# EAGLE design D32 Pro Breakout - TFT Touch (EAGLE 9.5.2)
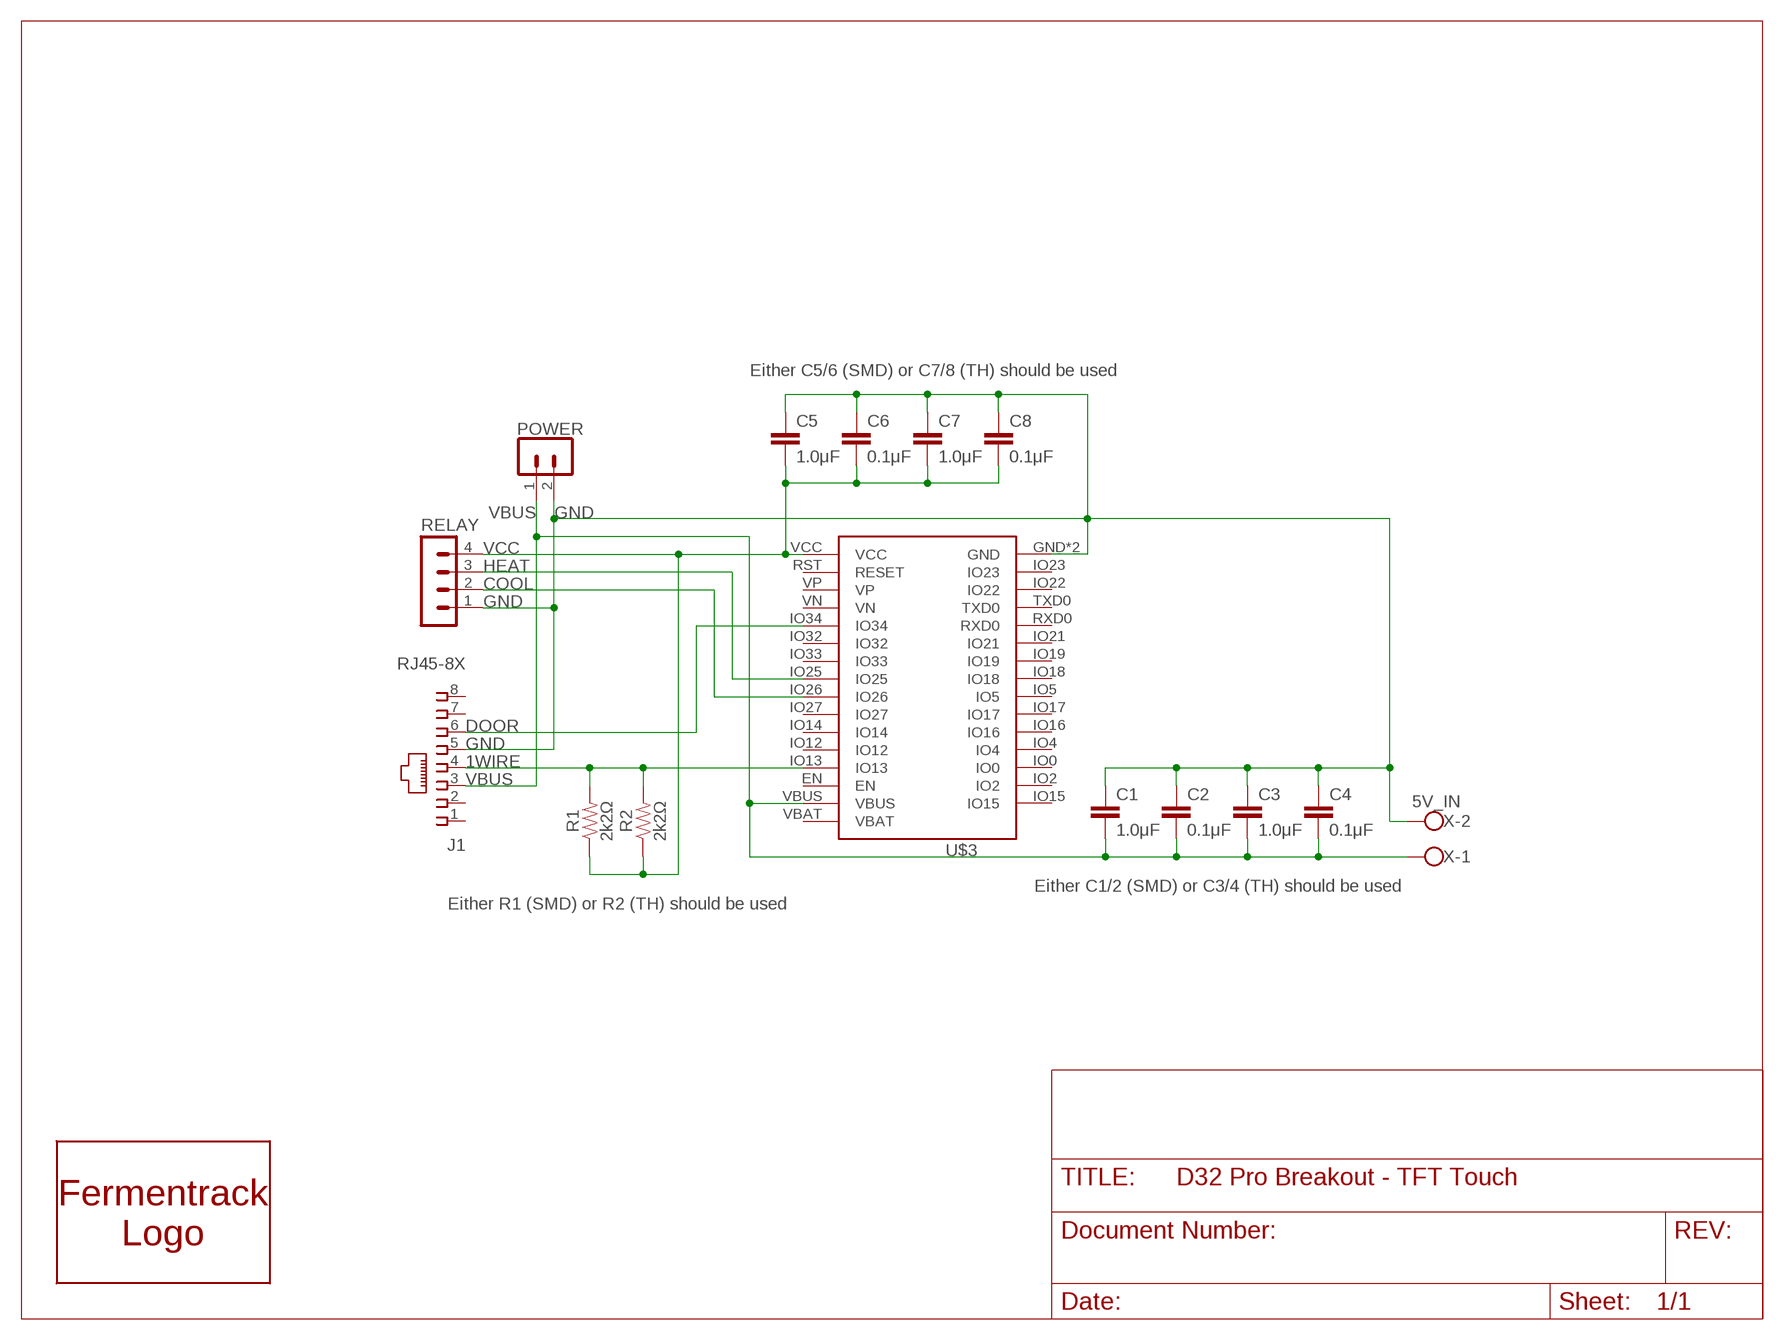
[diagram p0: schematic, sheet 1]

## Parts
C1  1.0μF  CAP_SMD1206  [SMD-1206]
C2  0.1μF  CAP_SMD1206  [SMD-1206]
C3  1.0μF  CAP_CERAMIC_2.54  [CAP_PTH-2.54]
C4  0.1μF  CAP_CERAMIC_2.54  [CAP_PTH-2.54]
C5  1.0μF  CAP_SMD1206  [SMD-1206]
C6  0.1μF  CAP_SMD1206  [SMD-1206]
C7  1.0μF  CAP_CERAMIC_2.54  [CAP_PTH-2.54]
C8  0.1μF  CAP_CERAMIC_2.54  [CAP_PTH-2.54]
J1  RJ45-8X  [RJ45-NO-SHIELD-NOLINE]
R1  2k2Ω  RES_SMD1206  [SMD-1206]
R2  2k2Ω  1KOHM-HORIZ-1/4W-5%  [AXIAL-0.3]
RELAY  HDR-4  [HDR-4_VERT]
U$3  WEMOS-D32D32_PRO_NO-BATT  [D32_PRO_NO-BATT]
U$5  POWER  HDR-2  [HDR-2_VERT]
U$6  LOGO_FERMENTRACKFERMENTRACK-LOGO_HALFINCH  [FERMENTRACK-LOGO_SM]
X  5V_IN  W237-102  [W237-102]

## Nets
1WIRE: J1.4 R1.2 R2.P$2 U$3.IO13
COOL: RELAY.2 U$3.IO26
DOOR: J1.6 U$3.IO34
GND [Gnd]: C1.1 C2.1 C3.1 C4.1 C5.1 C6.1 C7.1 C8.1 J1.5 RELAY.1 U$3.GND U$3.GND2(GND) U$5.2 X.2
HEAT: RELAY.3 U$3.IO25
VBUS [5v]: C1.2 C2.2 C3.2 C4.2 J1.3 U$3.VBUS U$5.1 X.1
VCC [3v]: C5.2 C6.2 C7.2 C8.2 R1.1 R2.P$1 RELAY.4 U$3.VCC
Unconnected: J1.1 J1.2 J1.7 J1.8 U$3.EN U$3.IO0 U$3.IO2 U$3.IO4 U$3.IO5 U$3.IO12 U$3.IO14 U$3.IO15 U$3.IO16 U$3.IO17 U$3.IO18 U$3.IO19 U$3.IO21 U$3.IO22 U$3.IO23 U$3.IO27 U$3.IO32 U$3.IO33 U$3.RST(RESET) U$3.RXD0 U$3.TXD0 U$3.VBAT U$3.VN U$3.VP

## Notes on the sheet
- Either C5/6 (SMD) or C7/8 (TH) should be used
- Either C1/2 (SMD) or C3/4 (TH) should be used
- Either R1 (SMD) or R2 (TH) should be used

## Library data of the parts
C1 C2 C5 C6 = Donnie:CAP_SMD
C3 C4 C7 C8 = Donnie:CAP_CERAMIC_2.54
J1 = con-tycoelectronics:RJ45: CORCOM Modular RJ Jacks No Shield Source: www.tycoelectronics.com .. ENG_DS_1654001_1099_RJ_L_0507.pdf; MPN: RJ45-8X; OC_FARNELL: unknown; OC_NEWARK: 16R6101
R1 = Donnie:RES_SMD
R2 = SparkFun-Resistors:1KOHM: 1kΩ resistor A resistor is a passive two-terminal electrical component that implements electrical resistance as a circuit element. Resistors act to reduce current flow, and, at the same time, act to lower voltage levels within circuits. - Wikipedia; PROD_ID: RES-08380; VALUE: 1k
RELAY = Donnie:HDR-4: PIN HEADER
U$3 = Donnie:WEMOS-D32: D32_REVERSE is a Reverse silkscreen for placing the Wemos D32 on the underside of the board D32_NO-KEEPOUT removes the keepout area beneath the antenna on the D32 and provides a note to avoid components and traces.
U$5 = Donnie:HDR-2
U$6 = Logo_Fermentrack:LOGO_FERMENTRACK: Fermentrack Logo
X = con-wago-500:W237-102: WAGO SCREW CLAMP; MPN: 237-102; OC_FARNELL: unknown; OC_NEWARK: 70K9898

## Net classes
0 default: width 0.406 mm, clearance 0.406 mm
1 5v: width 0.406 mm, clearance 0.406 mm
2 3v: width 0.406 mm, clearance 0.406 mm
3 Gnd: width 0.406 mm, clearance 0.406 mm

## Board
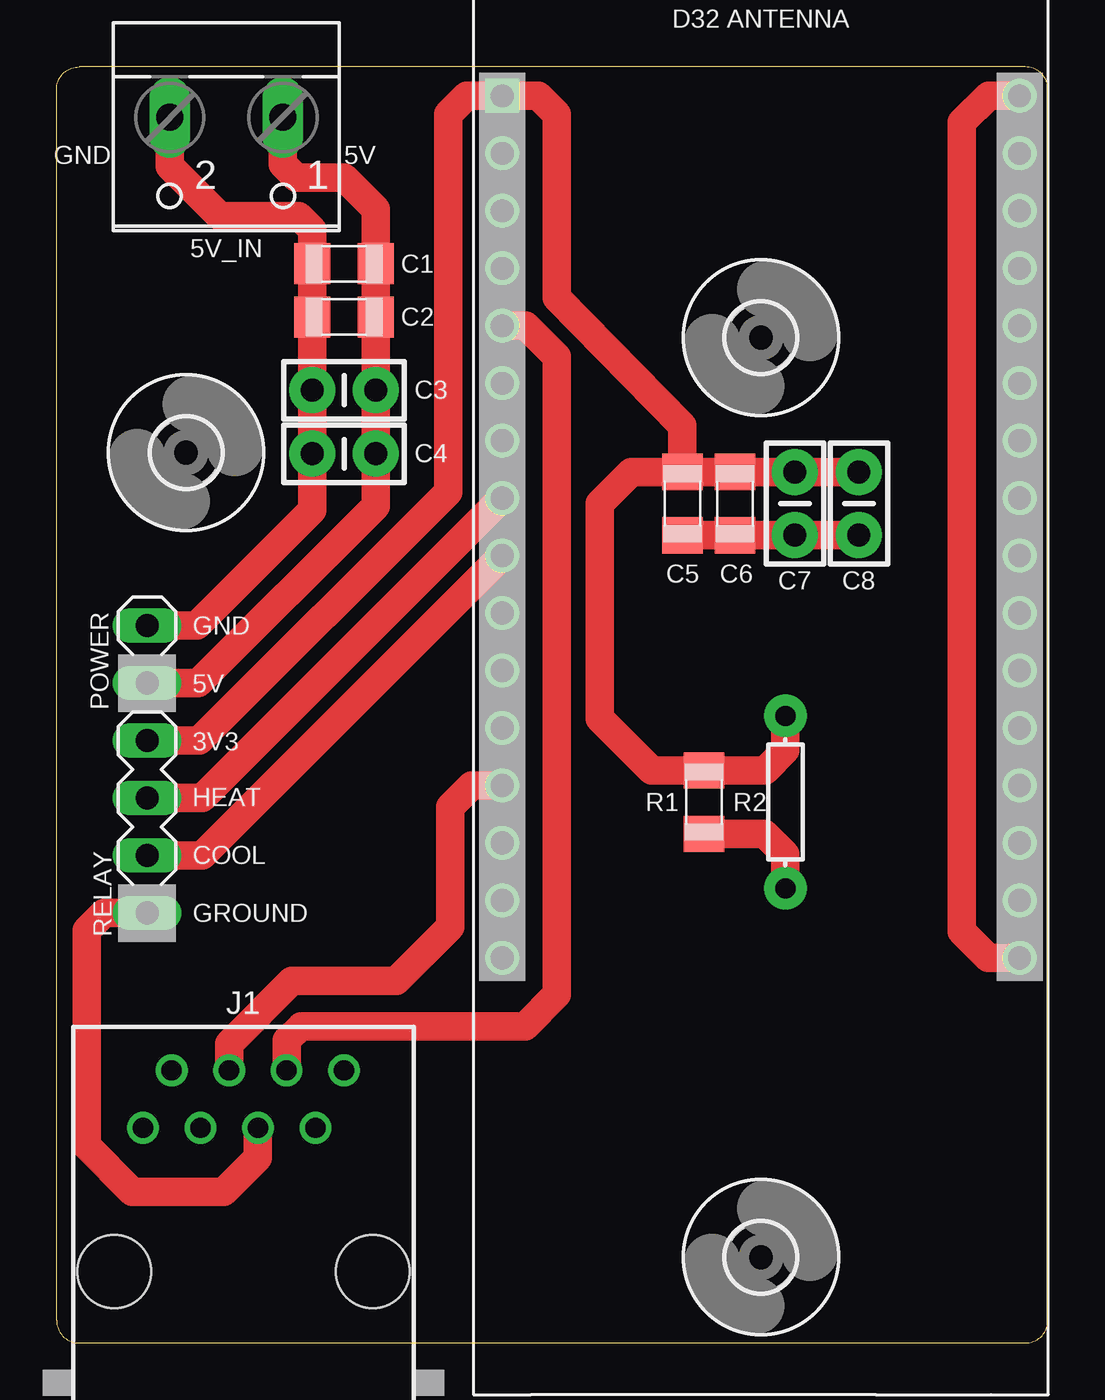
[diagram p1: board, top side]
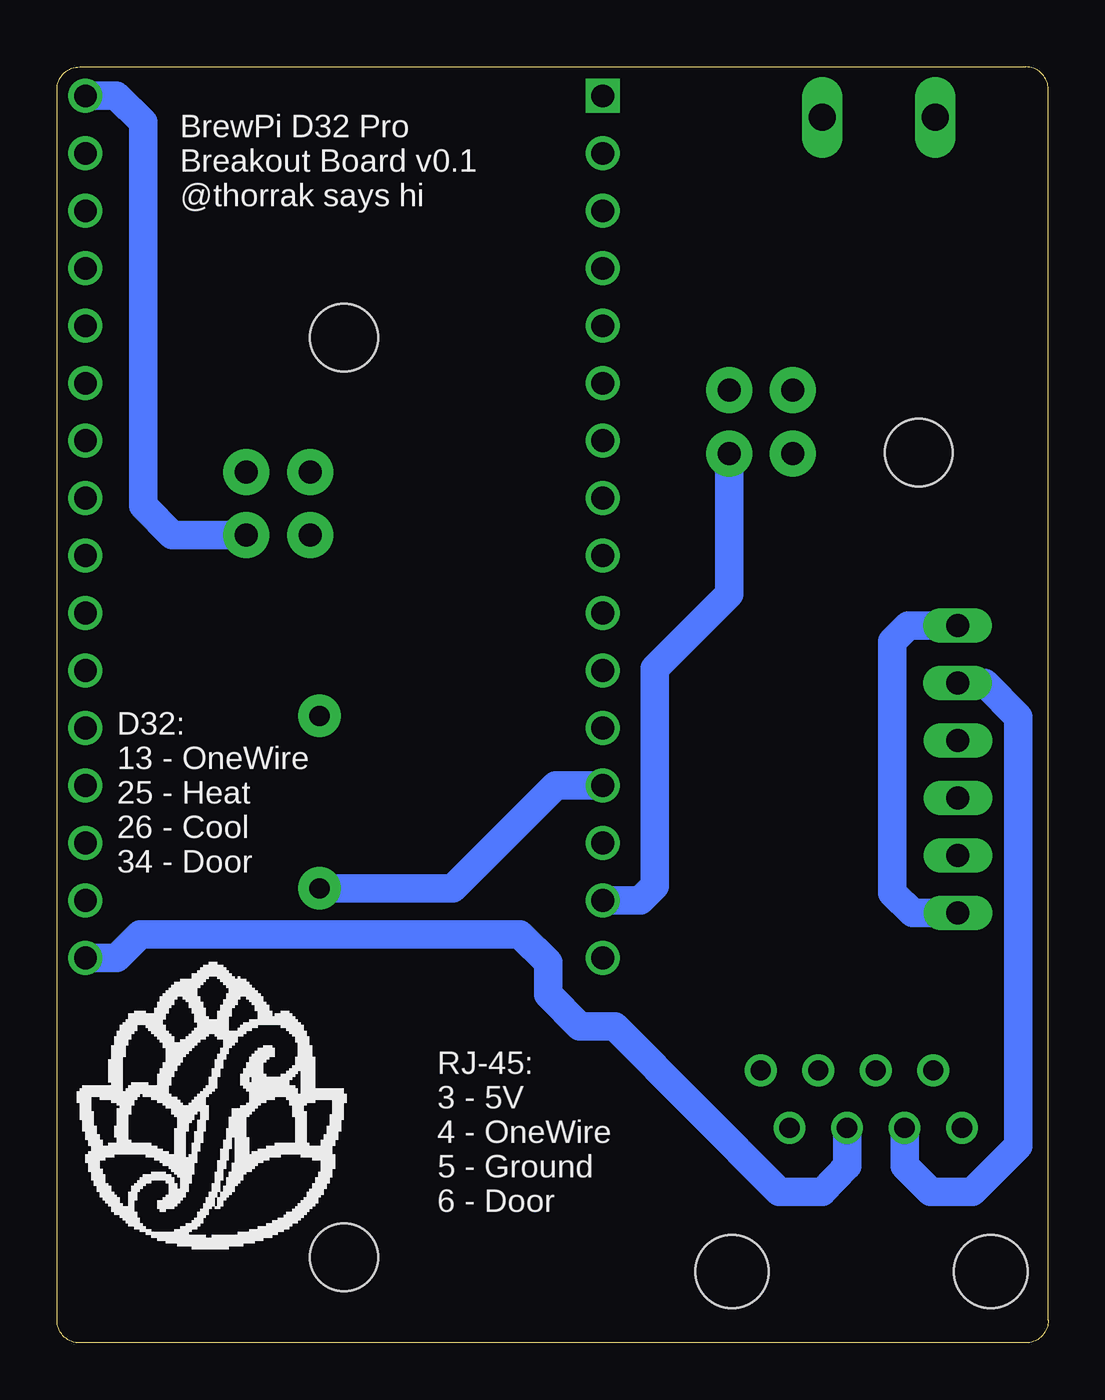
[diagram p2: board, bottom side, seen from below]

Size 43.8 x 56.4 mm. Coordinates in mm from the lower left corner, seen from the top.
Outline: 0,1 0,55.4 arc-90 1,56.4 42.8,56.4 arc-90 43.8,55.4 43.8,1 arc-90 42.8,0 1,0 arc-90 0,1
Copper layers (1*16): Top 0.0356mm / dielectric 1.5011mm / Bottom 0.0356mm
Design rules "PCBs_io *": minimum track width 6mil, minimum drill 13mil, track to track 8mil, track to pad 8mil, pad to pad 8mil, via to via 8mil, smd to smd 8mil, copper to edge 15mil, drill to drill 6mil, minimum pad ring 7mil, minimum via ring 7mil, stop-mask expansion 3mil, vias tented up to drill 0mil, thermal gap 10mil

### Footprints (pad centres in the part's own frame; a part is rotated, then mirrored left to right if it is on the bottom)
SMD-1206 = smd 1.6 x 1.8: 1 -1.4,0; 2 1.4,0
CAP_PTH-2.54 = drill 1.016 pad 2.032: 1 -1.397,0; 2 1.397,0
RJ45-NO-SHIELD-NOLINE = drill 0.9 pad 1.4: 1 -4.445,6.35; 2 -3.175,8.89; 3 -1.905,6.35; 4 -0.635,8.89; 5 0.635,6.35; 6 1.905,8.89; 7 3.175,6.35; 8 4.445,8.89 | hole 3.251: -5.715,0; 5.715,0
AXIAL-0.3 = drill 0.9 pad 1.88: P$1 -3.81,0; P$2 3.81,0
HDR-4_VERT = drill 1.016 long: 1 0,0; 2 2.54,0; 3 5.08,0; 4 7.62,0
3,0 = hole 3: 0,0
D32_PRO_NO-BATT = drill 1: EN -11.43,-12.7; GND 11.43,20.32; GND2 11.43,-17.78; IO0 11.43,-10.16; IO2 11.43,-12.7; IO4 11.43,-7.62; IO5 11.43,0; IO12 -11.43,-7.62; IO13 -11.43,-10.16; IO14 -11.43,-5.08; IO15 11.43,-15.24; IO16 11.43,-5.08; IO17 11.43,-2.54; IO18 11.43,2.54; IO19 11.43,5.08; IO21 11.43,7.62; IO22 11.43,15.24; IO23 11.43,17.78; IO25 -11.43,2.54; IO26 -11.43,0; IO27 -11.43,-2.54; IO32 -11.43,7.62; IO33 -11.43,5.08; IO34 -11.43,10.16; RST -11.43,17.78; RXD0 11.43,10.16; TXD0 11.43,12.7; VBAT -11.43,-17.78; VBUS -11.43,-15.24; VN -11.43,12.7; VP -11.43,15.24 | drill 1 square: VCC -11.43,20.32
HDR-2_VERT = drill 1.016 long: 1 0,0; 2 2.54,0
W237-102 = drill 1.194 long: 1 -2.5,-1.27; 2 2.5,-1.27

### Placement (x,y rotation side)
C1  12.7,47.7 0 top
C2  12.7,45.34 0 top
C3  12.7,42.11 0 top
C4  12.7,39.3 0 top
C5  27.65,37.1 90 top
C6  29.97,37.1 90 top
C7  32.62,37.1 90 top
C8  35.45,37.1 90 top
J1  8.26,3.15 0 top
R1  28.6,23.9 270 top
R2  32.2,23.9 270 top
RELAY  4,19 90 top
U$1  [3,0]  31.12,44.43 0 top
U$2  [3,0]  5.72,39.35 0 top
U$3  31.12,34.8 0 top
U$4  [3,0]  31.12,3.79 0 top
U$5  4,29.16 90 top
U$6  43.25,4.21 0 bottom
X  7.5,52.9 180 top

### Tracks (layer width: path | path; a pad name or v marks a point on that pad's centre or on a via)
1WIRE
  Top 1.27: J1.4 7.62,13.22 10.4,16 15.01,16 17.4,18.39 17.4,23.7 18.34,24.64 U$3.IO13 | R2.P$2 32.2,21.6 31.3,22.5 R1.2
  Bottom 1.27: U$3.IO13 21.76,24.64 26.31,20.09 R2.P$2
COOL
  Top 1.27: U$3.IO26 6.43,21.54 RELAY.2
DOOR
  Top 1.27: U$3.IO34 20.74,44.96 22.1,43.6 22.1,42.55 22.1,15.4 20.7,14 10.8,14 10.16,13.37 J1.6
GND
  Top 1.27: X.2 5,52 7.2,49.8 10.7,49.8 11.3,49.2 C1.1 C2.1 C3.1 C4.1 11.3,36.8 6.2,31.7 U$5.2 | U$3.GND 41.17,55.12 40,53.95 40,18.19 41.17,17.02 U$3.GND2 | RELAY.1 2.1,19 1.33,18.22 1.33,8.71 3.35,6.68 7.39,6.68 8.89,8.18 J1.5 | C5.1 C6.1 C7.1 C8.1
  Bottom 1.27: U$3.GND 41.17,55.12 40,53.95 40,37 38.7,35.7 C8.1 | J1.5 8.89,7.82 9.98,6.68 11.89,6.68 19.15,13.99 20.7,13.99 22.1,15.4 22.1,16.82 23.35,18.06 40.13,18.06 41.17,17.02 U$3.GND2 | U$5.2 6.2,31.7 6.9,31 6.9,19.9 6,19 RELAY.1
HEAT
  Top 1.27: U$3.IO25 6.43,24.08 RELAY.3
VBUS
  Top 1.27: U$5.1 6.26,29.16 14.1,37 C4.2 C3.2 C2.2 C1.2 14.1,50.1 12.7,51.5 10.6,51.5 10,52.1 X.1
  Bottom 1.27: U$3.VBUS 18.04,19.56 17.4,20.2 17.4,29.8 14.1,33.1 C4.2 | U$5.1 2.82,29.16 1.32,27.66 1.32,8.71 3.35,6.68 5.21,6.68 6.36,7.83 J1.3
VCC
  Top 1.27: C5.2 25.4,38.5 24,37.1 24,27.6 26.3,25.3 R1.1 31.3,25.3 32.2,26.2 R2.P$1 | C5.2 27.65,40.55 22.1,46.2 22.1,54.3 21.28,55.12 U$3.VCC 18.12,55.12 17.3,54.3 17.3,37.61 6.31,26.62 RELAY.4 | C8.2 C7.2 C6.2 C5.2

### Text on the board
tNames: GND | 5V | GND | 5V | 3V3 | HEAT | COOL | GROUND
bNames: BrewPi D32 Pro / Breakout Board v0.1 / @thorrak says hi | D32: / 13 - OneWire / 25 - Heat / 26 - Cool / 34 - Door | RJ-45: / 3 - 5V / 4 - OneWire / 5 - Ground / 6 - Door